# Altium schematic sheet Buck.SchDoc
size A4; SheetNumber: 1; SheetTotal: 1
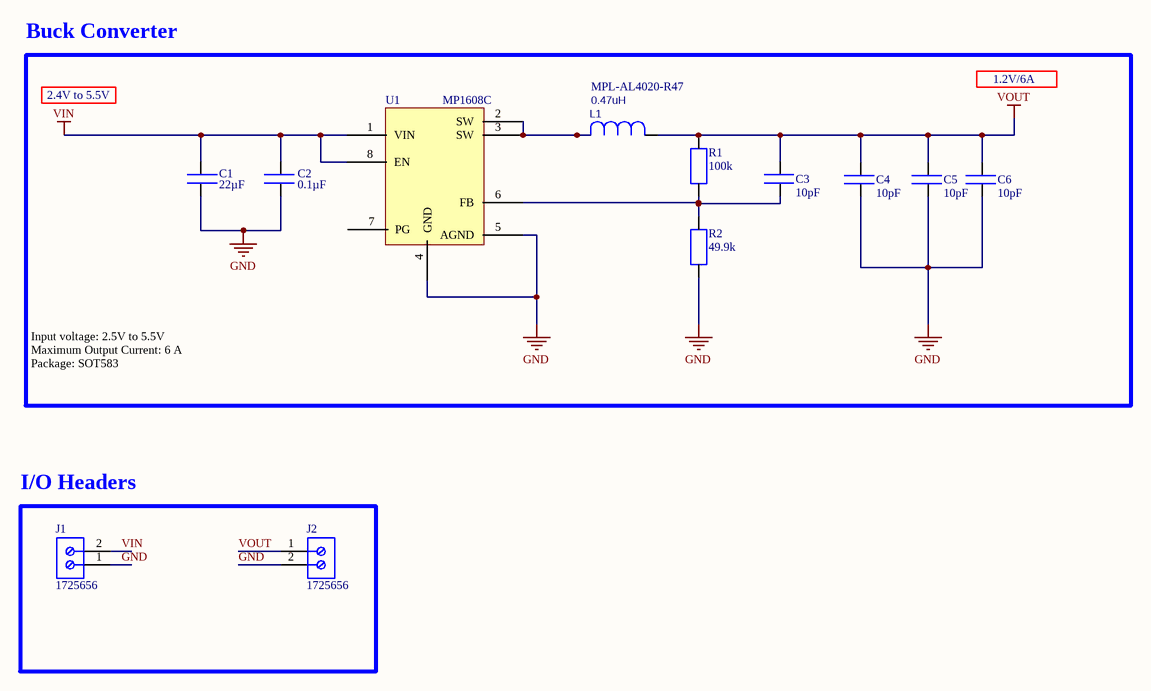
[diagram p0: Buck.SchDoc]

## Parts
C1  22µF  [CAP_0603]
C2  0.1µF  [CAP_0603]
C3  10pF  [CAP_0603]
C4  10pF  [CAP_0603]
C5  10pF  [CAP_0603]
C6  10pF  [CAP_0603]
J1  1725656  [PHOE-1725656-2]
J2  1725656  [PHOE-1725656-2]
L1  value 0.47uH  [MPL-AL4020-R47]  (hidden comment: COILCRAFT/LPO2506IB-682)
R1  100k  [RES_0603]
R2  49.9k  [RES_0603]
U1  MP1608C  [MP1608C_1]

## Blocks framed on the sheet
Buck Converter: C1-C6 L1 R1 R2 U1
I/O Headers: J1 J2

## Nets
GND: C1.1 C2.2 C4.2 C5.2 C6.2 J1.1 J2.2 R2.1 U1.4(GND) U1.5(AGND)
VIN: C1.2 C2.1 J1.2 U1.1(VIN) U1.8(EN)
VOUT: C3.1 C4.1 C5.1 C6.1 J2.1 L1.2 R1.2
NetC3_2: C3.2 R1.1 R2.2 U1.6(FB)
NetL1_1: L1.1 U1.2(SW) U1.3(SW)

Not connected (* = marked no-connect by the designer): U1 7(PG)

## Notes on the sheet
- 2.4V to 5.5V
- 1.2V/6A
- Input voltage: 2.5V to 5.5V
  Maximum Output Current: 6 A
  Package: SOT583
- (in symbol TOKO106C) MPL-AL4020-R47

## Library data of the parts
C1-C6 = CAP_0603: Capacitor SMD 0603 Generic; Manufacturer: YAGEO; Manufacturer Part Number: CC0603KRX7R8BB104; Capacitance: 100 nF; Tolerance: 10%; LCSC Part Number: C92490
J1 J2 = CMP-2000-05299-1: Male Header, Pitch 2.54 mm, 1 x 2 Position, Height 9 mm, Tail Length 3.5 mm; Manufacturer: Phoenix Contact; Number of contacts: 2; Content: 250pc(s); Pitch: 2.54mm; Industrial packaging: Yes; Colour: Green; Manufacturer part No.: 1725656; Type: MPT0,5/2-2,54; Datasheet URL: http://datasheet.octopart.com/1725656-Phoenix-Contact-datasheet-5302866.pdf; Manufacturer URL: http://www.phoenixcontact.com/; Datasheet Version: Apr-08
L1 = TOKO106C
R1 R2 = RES_0603: Resistor SMD 0603 Generic; Manufacturer: YAGEO; Manufacturer Part Number: NT0603BRD0711K1L; Tolerance: 0.1%; Resistance: 11.1 kOhm; LCSC Part Number: C5197511
U1 = MP1608C: The MP1608C is a monolithic, step-down switchmode converter with built-in internal power / MOSFETs. It achieves 6A of continuous output / current (IOUT) from a 2.4V to 5.5V input voltage / (VIN) range, with excellent load and line / regulation. The output voltage (VOUT) can be / regulated to as low as 0.4V. / The constant-on-time (COT) control scheme / provides fast transient response and facilitates / loop stabilization. Fault protections include / cycle-by-cycle current limiting and thermal / shutdown. / The MP1608C is well-suited for a wide range of / applications including high-performance digital / signal processors (DSPs), wireless power, / portable and mobile devices, and other lowpower systems. / The MP1608C requires a minimal number of / readily available, standard external components. / It is available in an ultra-small SOT583 package.; Manufacturer: Monolithic Power Systems (MPS); Manufacturer Part Number: MP1608CGTL-P; Switching Frequency: 1.25MHz; Operating Junction Temp (Tj): -40°C to +125°C; Feedback Voltage (Vfb): 0.6V; Input Voltage (Min): 2.4V; Input Voltage (Max): 5.5V; Output Current (Max): 6A; Package: SOT583-8; Mounting Type: Surface Mount (SMD)